# EAGLE schematic main_schematic (EAGLE 8.7.0)
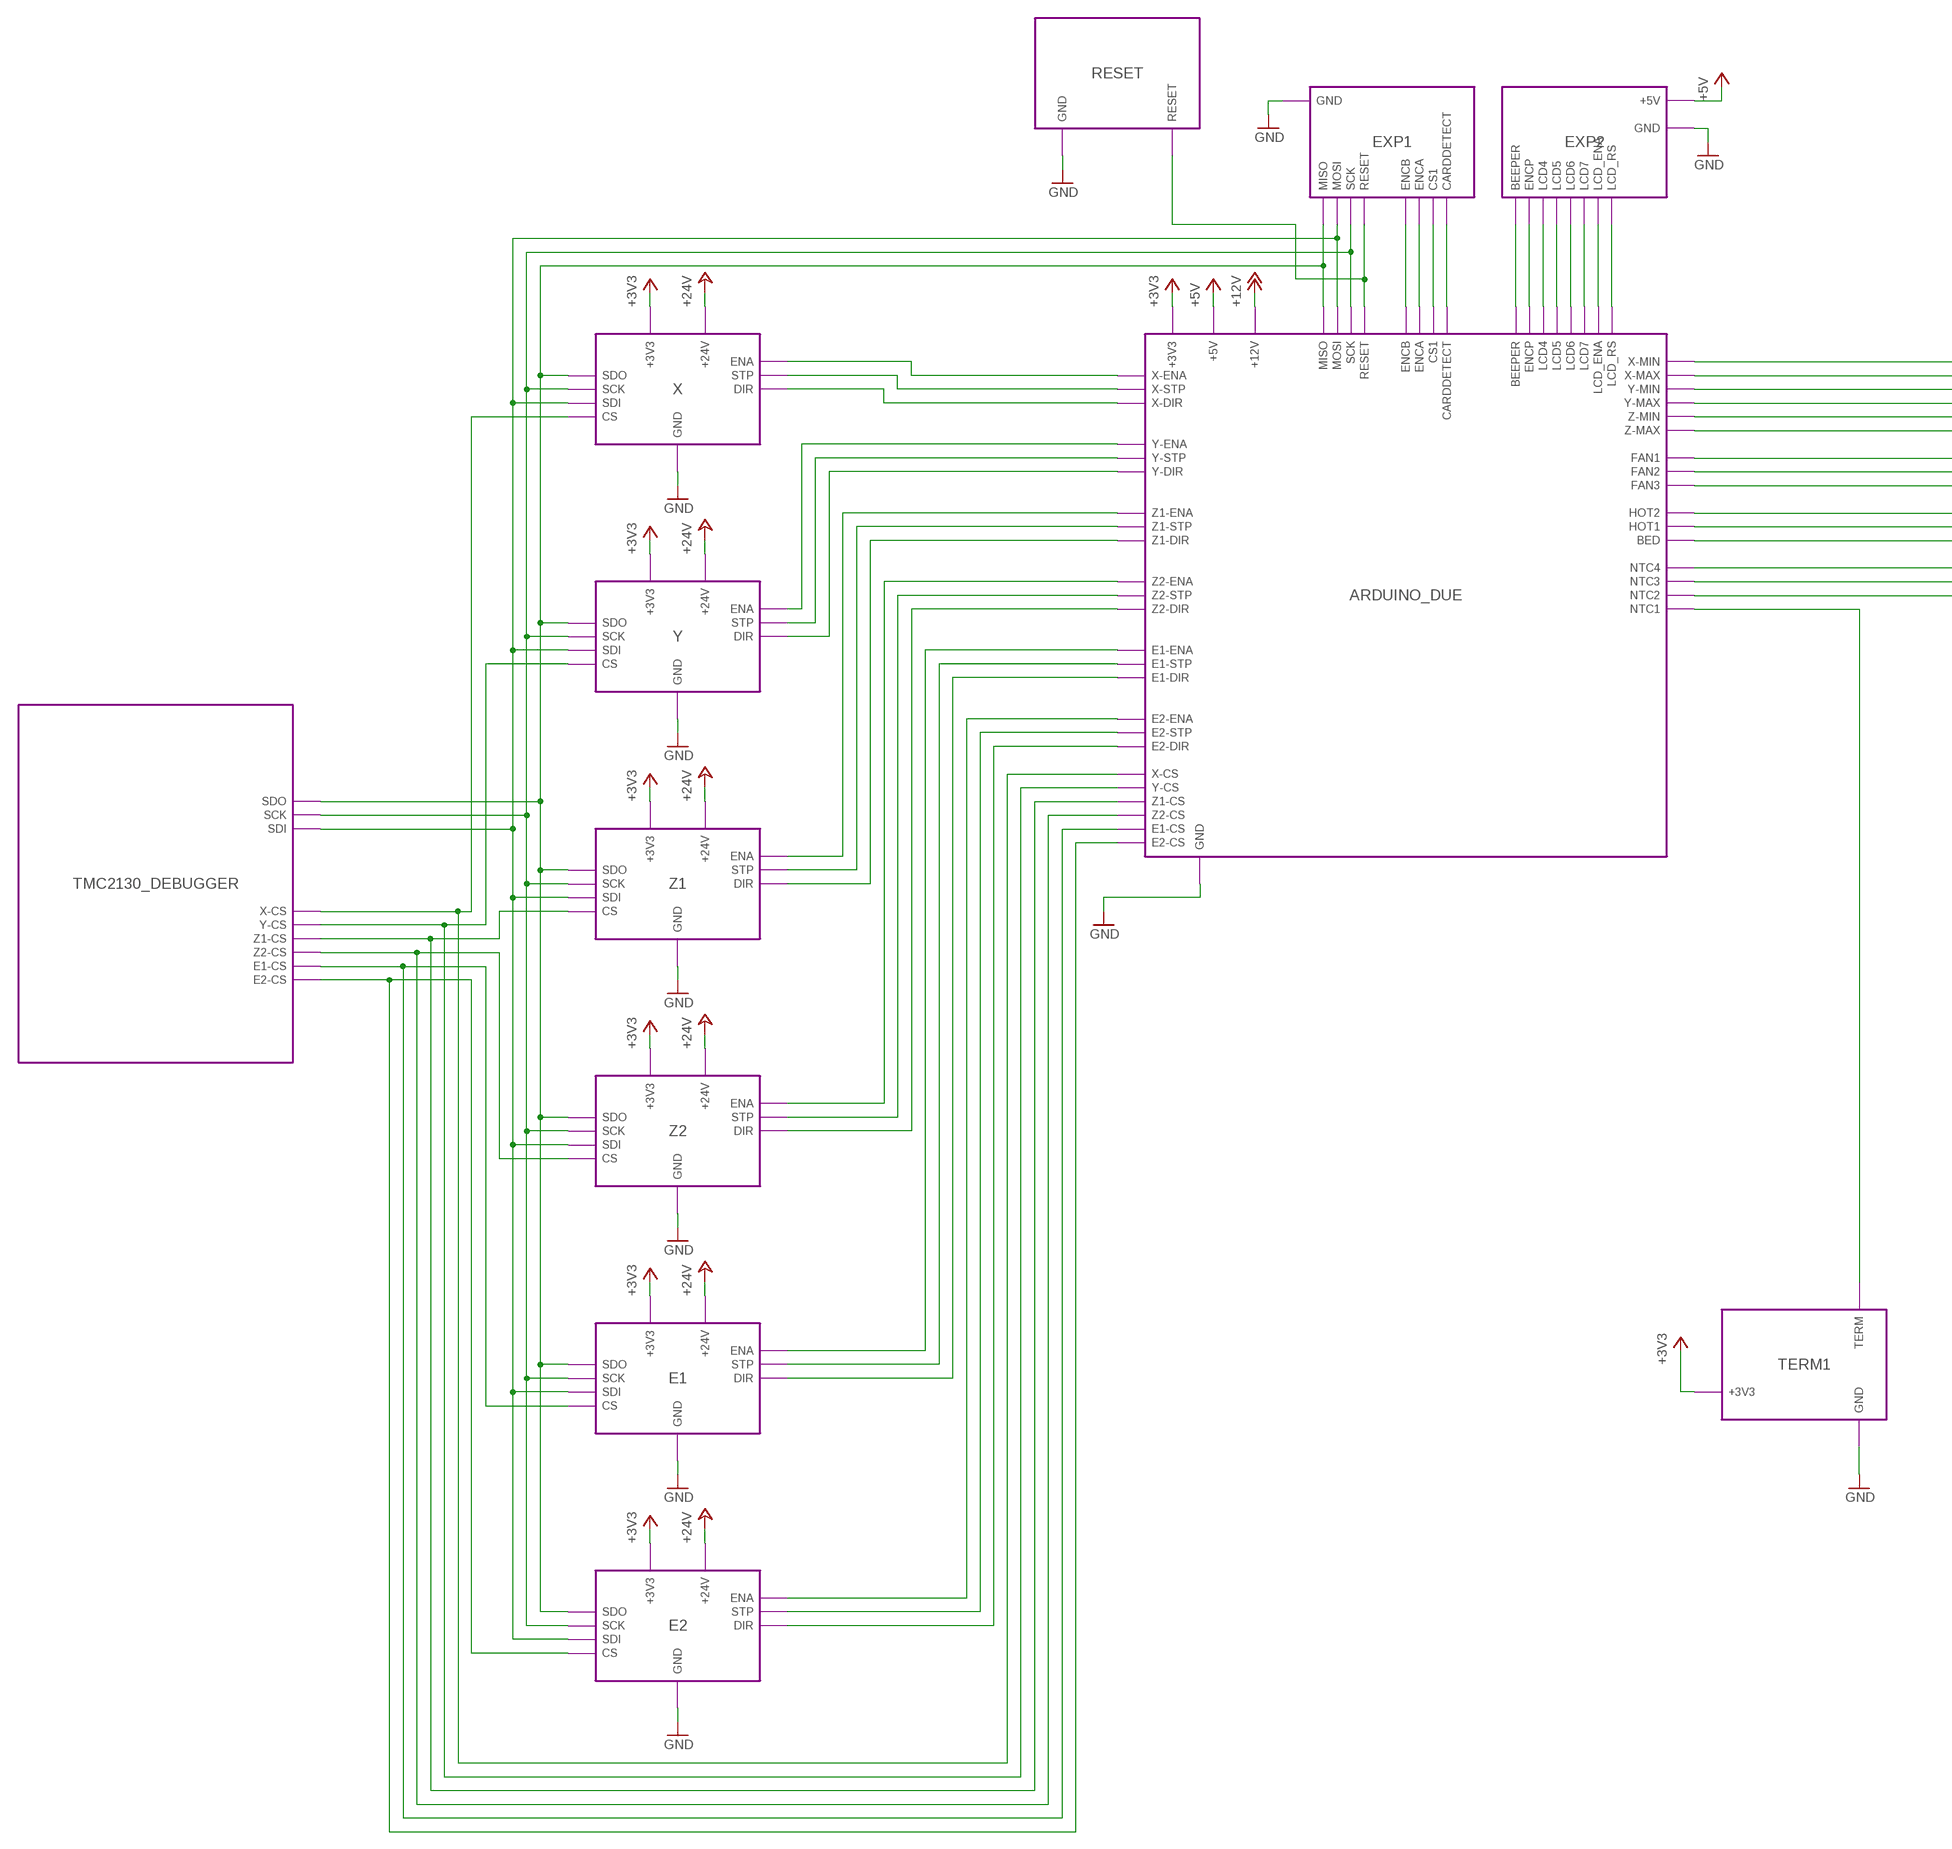
[diagram p0: schematic, sheet 1, part 1 of 2]
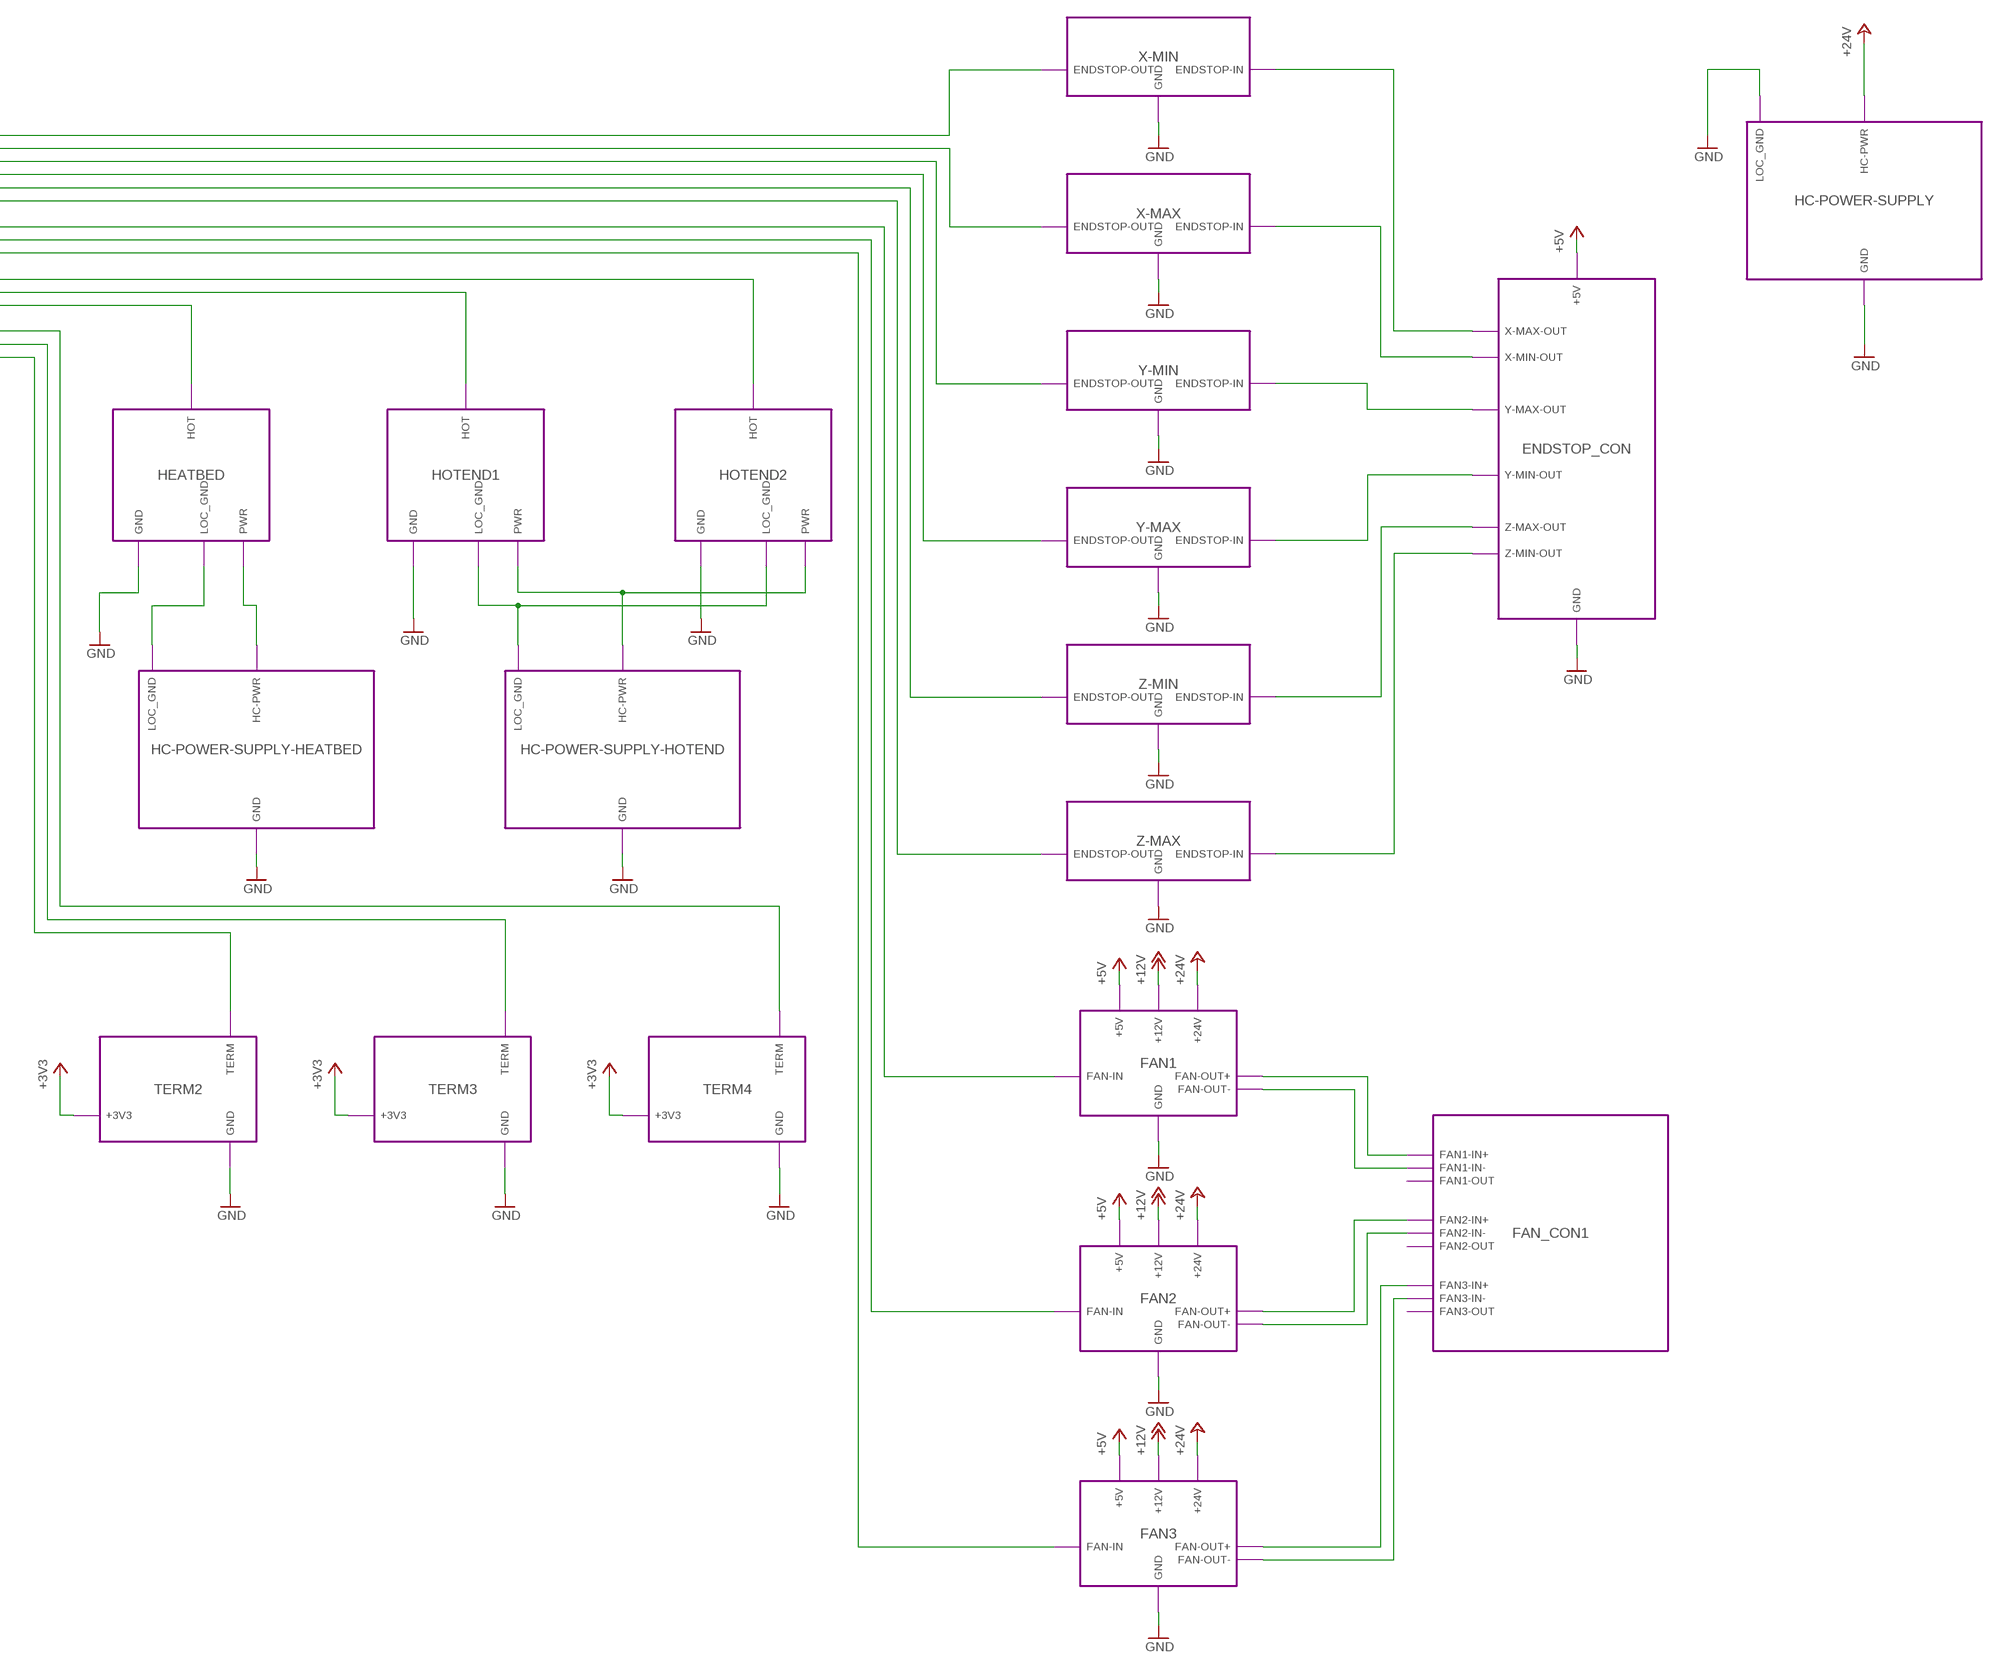
[diagram p1: schematic, sheet 1, part 2 of 2]

## Module instances
X-MIN = ENDSTOP
X-MAX = ENDSTOP
Y-MIN = ENDSTOP
Y-MAX = ENDSTOP
Z-MIN = ENDSTOP
Z-MAX = ENDSTOP
ARDUINO_DUE = CPU
ENDSTOP_CON = ENDSTOP_CON
FAN1 = FAN
FAN2 = FAN
FAN3 = FAN
FAN_CON1 = FAN_CON
EXP1 = EXP1
EXP2 = EXP2
X = MOTOR
Y = MOTOR
Z1 = MOTOR
Z2 = MOTOR
E1 = MOTOR
E2 = MOTOR
TMC2130_DEBUGGER = TMC2130_DEBUGGER
RESET = RESET
HOTEND1 = MOSFET-OUTPUT
HOTEND2 = MOSFET-OUTPUT
HC-POWER-SUPPLY-HOTEND = HC-POWER-SUPPLY
HC-POWER-SUPPLY-HEATBED = HC-POWER-SUPPLY
HC-POWER-SUPPLY = HC-POWER-SUPPLY
TERM1 = TERM
TERM2 = TERM
TERM3 = TERM
TERM4 = TERM
HEATBED = MOSFET-OUTPUT

## Nets
+3V3: port ARDUINO_DUE.+3V3 X.+3V3 Y.+3V3 Z1.+3V3 Z2.+3V3 E1.+3V3 E2.+3V3 TERM4.+3V3 TERM3.+3V3 TERM2.+3V3 TERM1.+3V3
+5V: port ENDSTOP_CON.+5V FAN1.+5V FAN2.+5V FAN3.+5V ARDUINO_DUE.+5V EXP2.+5V
+12V: port FAN3.+12V FAN2.+12V FAN1.+12V ARDUINO_DUE.+12V
+24V: port FAN3.+24V FAN2.+24V FAN1.+24V X.+24V Y.+24V Z1.+24V Z2.+24V E1.+24V E2.+24V HC-POWER-SUPPLY.HC-PWR
GND: port Y-MAX.GND Z-MIN.GND Z-MAX.GND Y-MIN.GND X-MAX.GND X-MIN.GND ENDSTOP_CON.GND FAN1.GND FAN2.GND FAN3.GND ARDUINO_DUE.GND EXP1.GND EXP2.GND X.GND Y.GND Z1.GND Z2.GND E1.GND E2.GND RESET.GND HC-POWER-SUPPLY-HEATBED.GND HC-POWER-SUPPLY-HOTEND.GND HOTEND1.GND HOTEND2.GND HEATBED.GND TERM4.GND TERM3.GND TERM2.GND TERM1.GND HC-POWER-SUPPLY.LOC_GND HC-POWER-SUPPLY.GND
N$1: port ARDUINO_DUE.MISO EXP1.MISO X.SDO Y.SDO Z1.SDO Z2.SDO E1.SDO E2.SDO TMC2130_DEBUGGER.SDO
N$2: port ARDUINO_DUE.MOSI EXP1.MOSI X.SDI E2.SDI Y.SDI E1.SDI Z2.SDI Z1.SDI TMC2130_DEBUGGER.SDI
N$3: port ARDUINO_DUE.SCK EXP1.SCK X.SCK Y.SCK Z1.SCK Z2.SCK E1.SCK E2.SCK TMC2130_DEBUGGER.SCK
N$4: port ARDUINO_DUE.RESET EXP1.RESET RESET.RESET
N$5: port ARDUINO_DUE.ENCB EXP1.ENCB
N$6: port ARDUINO_DUE.ENCA EXP1.ENCA
N$7: port ARDUINO_DUE.CS1 EXP1.CS1
N$8: port ARDUINO_DUE.CARDDETECT EXP1.CARDDETECT
N$9: port ARDUINO_DUE.BEEPER EXP2.BEEPER
N$10: port ARDUINO_DUE.ENCP EXP2.ENCP
N$11: port ARDUINO_DUE.X-MIN X-MIN.ENDSTOP-OUT
N$12: port ARDUINO_DUE.LCD4 EXP2.LCD4
N$13: port ARDUINO_DUE.LCD5 EXP2.LCD5
N$14: port ARDUINO_DUE.LCD6 EXP2.LCD6
N$15: port ARDUINO_DUE.LCD7 EXP2.LCD7
N$16: port ARDUINO_DUE.LCD_ENA EXP2.LCD_ENA
N$17: port ARDUINO_DUE.LCD_RS EXP2.LCD_RS
N$18: port ARDUINO_DUE.X-ENA X.ENA
N$19: port ARDUINO_DUE.X-STP X.STP
N$20: port ARDUINO_DUE.X-DIR X.DIR
N$21: port ARDUINO_DUE.Y-ENA Y.ENA
N$22: port ARDUINO_DUE.Y-STP Y.STP
N$23: port ARDUINO_DUE.Y-DIR Y.DIR
N$24: port ARDUINO_DUE.X-MAX X-MAX.ENDSTOP-OUT
N$25: port ARDUINO_DUE.Z1-ENA Z1.ENA
N$26: port ARDUINO_DUE.Y-MIN Y-MIN.ENDSTOP-OUT
N$27: port ARDUINO_DUE.Y-MAX Y-MAX.ENDSTOP-OUT
N$28: port ARDUINO_DUE.Z-MIN Z-MIN.ENDSTOP-OUT
N$29: port ARDUINO_DUE.Z-MAX Z-MAX.ENDSTOP-OUT
N$30: port ENDSTOP_CON.X-MAX-OUT X-MIN.ENDSTOP-IN
N$31: port ENDSTOP_CON.X-MIN-OUT X-MAX.ENDSTOP-IN
N$32: port ENDSTOP_CON.Y-MAX-OUT Y-MIN.ENDSTOP-IN
N$33: port ENDSTOP_CON.Y-MIN-OUT Y-MAX.ENDSTOP-IN
N$34: port ENDSTOP_CON.Z-MAX-OUT Z-MIN.ENDSTOP-IN
N$35: port ENDSTOP_CON.Z-MIN-OUT Z-MAX.ENDSTOP-IN
N$36: port FAN1.FAN-OUT+ FAN_CON1.FAN1-IN+
N$37: port FAN1.FAN-OUT- FAN_CON1.FAN1-IN-
N$38: port FAN2.FAN-OUT+ FAN_CON1.FAN2-IN+
N$39: port FAN2.FAN-OUT- FAN_CON1.FAN2-IN-
N$40: port FAN3.FAN-OUT+ FAN_CON1.FAN3-IN+
N$41: port FAN3.FAN-OUT- FAN_CON1.FAN3-IN-
N$42: port ARDUINO_DUE.Z1-STP Z1.STP
N$43: port ARDUINO_DUE.Z1-DIR Z1.DIR
N$44: port ARDUINO_DUE.Z2-ENA Z2.ENA
N$45: port ARDUINO_DUE.Z2-STP Z2.STP
N$46: port ARDUINO_DUE.Z2-DIR Z2.DIR
N$47: port ARDUINO_DUE.E1-ENA E1.ENA
N$48: port ARDUINO_DUE.FAN1 FAN1.FAN-IN
N$49: port ARDUINO_DUE.FAN2 FAN2.FAN-IN
N$50: port ARDUINO_DUE.FAN3 FAN3.FAN-IN
N$51: port ARDUINO_DUE.E1-STP E1.STP
N$52: port ARDUINO_DUE.E1-DIR E1.DIR
N$53: port ARDUINO_DUE.E2-ENA E2.ENA
N$54: port ARDUINO_DUE.E2-STP E2.STP
N$55: port ARDUINO_DUE.E2-DIR E2.DIR
N$56: port TMC2130_DEBUGGER.X-CS X.CS ARDUINO_DUE.X-CS
N$57: port Y.CS TMC2130_DEBUGGER.Y-CS ARDUINO_DUE.Y-CS
N$58: port Z1.CS TMC2130_DEBUGGER.Z1-CS ARDUINO_DUE.Z1-CS
N$59: port TMC2130_DEBUGGER.Z2-CS Z2.CS ARDUINO_DUE.Z2-CS
N$60: port TMC2130_DEBUGGER.E1-CS E1.CS ARDUINO_DUE.E1-CS
N$61: port E2.CS TMC2130_DEBUGGER.E2-CS ARDUINO_DUE.E2-CS
N$62: port HC-POWER-SUPPLY-HOTEND.LOC_GND HOTEND1.LOC_GND HOTEND2.LOC_GND
N$63: port HC-POWER-SUPPLY-HOTEND.HC-PWR HOTEND1.PWR HOTEND2.PWR
N$64: port ARDUINO_DUE.HOT2 HOTEND2.HOT
N$65: port ARDUINO_DUE.HOT1 HOTEND1.HOT
N$66: port HC-POWER-SUPPLY-HEATBED.LOC_GND HEATBED.LOC_GND
N$67: port HC-POWER-SUPPLY-HEATBED.HC-PWR HEATBED.PWR
N$68: port ARDUINO_DUE.BED HEATBED.HOT
N$69: port TERM4.TERM ARDUINO_DUE.NTC4
N$70: port ARDUINO_DUE.NTC3 TERM3.TERM
N$71: port ARDUINO_DUE.NTC2 TERM2.TERM
N$72: port ARDUINO_DUE.NTC1 TERM1.TERM

## Library data of the parts

## Module ENDSTOP
Ports: ENDSTOP-IN(in) ENDSTOP-OUT(out) GND(pwr)
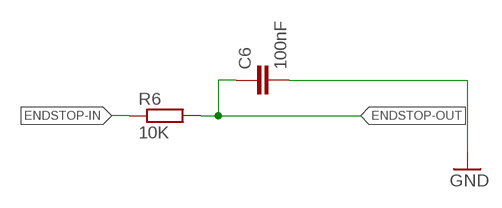
[diagram p2: schematic, module ENDSTOP, sheet 1]

### Parts
C6  100nF  C-EUC0805  [C0805]
R6  10K  R-EU_R0805  [R0805]

### Nets
ENDSTOP-IN: R6.1
ENDSTOP-OUT: C6.1 R6.2
GND: C6.2

### Library data of the parts
C6 = resistor:C-EU: CAPACITOR, European symbol
R6 = resistor:R-EU_: RESISTOR, European symbol

## Module CPU
Ports: X-MIN(in) X-MAX(in) Y-MIN(in) Y-MAX(in) Z-MIN(in) Z-MAX(in) +3V3(pwr) +5V(pwr) +12V(pwr) GND(pwr) FAN1(out) FAN2(out) FAN3(out) MISO(in) MOSI(out) SCK(out) RESET(in) ENCB(in) ENCA(in) CS1(out) CARDDETECT(in) BEEPER(out) ENCP(in) LCD4(out) LCD5(out) LCD6(out) LCD7(out) LCD_ENA(out) LCD_RS(out) Y-ENA(out) X-ENA(out) X-STP(out) X-DIR(out) Z1-STP(out) Y-STP(out) Y-DIR(out) Z1-ENA(out) Z1-DIR(out) Z2-ENA(out) Z2-STP(out) Z2-DIR(out) E1-ENA(out) E1-STP(out) E1-DIR(out) E2-ENA(out) E2-STP(out) E2-DIR(out) X-CS(out) Y-CS(out) Z1-CS(out) Z2-CS(out) E1-CS(out) E2-CS(out) HOT1(out) HOT2(out) BED(out) NTC4(in) NTC3(in) NTC2(in) NTC1(in)
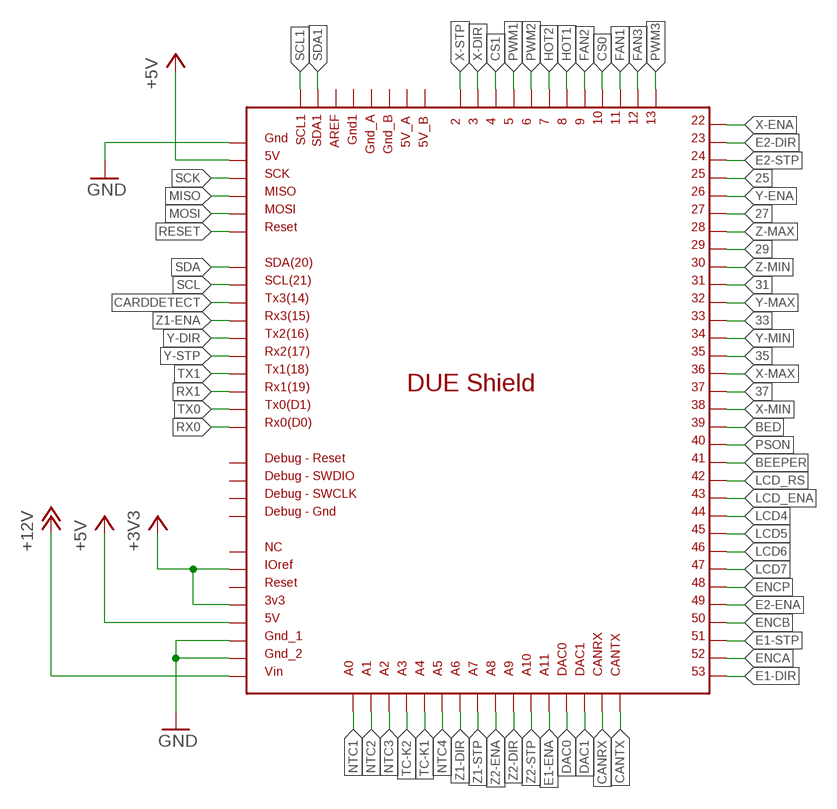
[diagram p3: schematic, module CPU, sheet 1]

### Parts
U$1  DUE(NORMAL)  [DUE(NORMAL)]

### Nets
25: U$1.25
27: U$1.27
29: U$1.29
31: U$1.31
33: U$1.33
35: U$1.35
37: U$1.37
+3V3: U$1.3V3 U$1.IOREF
+5V: U$1.5V U$1.GND_ICSP
+12V: U$1.VIN
BED: U$1.39
BEEPER: U$1.41
CANRX: U$1.CANRX
CANTX: U$1.CANTX
CARDDETECT: U$1.TX3
CS0: U$1.10
CS1: U$1.4
DAC0: U$1.DAC0
DAC1: U$1.DAC1
E1-DIR: U$1.53
E1-ENA: U$1.A11
E1-STP: U$1.51
E2-DIR: U$1.23
E2-ENA: U$1.49
E2-STP: U$1.24
ENCA: U$1.52
ENCB: U$1.50
ENCP: U$1.48
FAN1: U$1.11
FAN2: U$1.9
FAN3: U$1.12
GND: U$1.5V_ICSP U$1.GND_1 U$1.GND_2
HOT1: U$1.8
HOT2: U$1.7
LCD4: U$1.44
LCD5: U$1.45
LCD6: U$1.46
LCD7: U$1.47
LCD_ENA: U$1.43
LCD_RS: U$1.42
MISO: U$1.MISO_ICSP
MOSI: U$1.MOSI_ICSP
NTC1: U$1.A0
NTC2: U$1.A1
NTC3: U$1.A2
NTC4: U$1.A5
PSON: U$1.40
PWM1: U$1.5
PWM2: U$1.6
PWM3: U$1.13
RESET: U$1.RESET_ICSP
RX0: U$1.RX0
RX1: U$1.RX1
SCK: U$1.SCK_ICSP
SCL: U$1.SCL
SCL1: U$1.SCL1
SDA: U$1.SDA
SDA1: U$1.SDA1
TC-K1: U$1.A4
TC-K2: U$1.A3
TX0: U$1.TX0
TX1: U$1.TX1
X-DIR: U$1.3
X-ENA: U$1.22
X-MAX: U$1.36
X-MIN: U$1.38
X-STP: U$1.2
Y-DIR: U$1.TX2
Y-ENA: U$1.26
Y-MAX: U$1.32
Y-MIN: U$1.34
Y-STP: U$1.RX2
Z1-DIR: U$1.A6
Z1-ENA: U$1.RX3
Z1-STP: U$1.A7
Z2-DIR: U$1.A9
Z2-ENA: U$1.A8
Z2-STP: U$1.A10
Z-MAX: U$1.28
Z-MIN: U$1.30
Unconnected: U$1.5V_A U$1.5V_B U$1.AREF U$1.GND1 U$1.GND_A U$1.GND_B U$1.GND_DEBUG U$1.NC U$1.RESET U$1.RESET_DEBUG U$1.SWCLK_DEBUG U$1.SWDIO_DEBUG

### Library data of the parts
U$1 = DUElib130425:DUE(NORMAL)

## Module ENDSTOP_CON
Ports: X-MAX-OUT(out) X-MIN-OUT(out) Y-MAX-OUT(out) Y-MIN-OUT(out) Z-MAX-OUT(out) Z-MIN-OUT(out) +5V(pwr) GND(pwr)
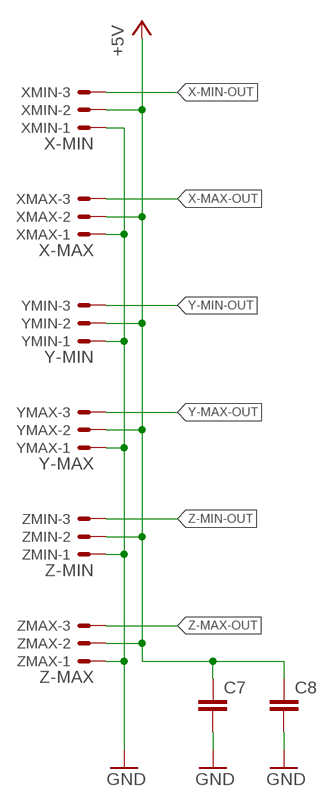
[diagram p4: schematic, module ENDSTOP_CON, sheet 1]

### Parts
C7  C-EUC0805  [C0805]
C8  C-EUC0805  [C0805]
XMAX  X-MAX  JST-XH-03-PIN-LONG-PAD  [JST-XH-03-PACKAGE-LONG-PAD]
XMIN  X-MIN  JST-XH-03-PIN-LONG-PAD  [JST-XH-03-PACKAGE-LONG-PAD]
YMAX  Y-MAX  JST-XH-03-PIN-LONG-PAD  [JST-XH-03-PACKAGE-LONG-PAD]
YMIN  Y-MIN  JST-XH-03-PIN-LONG-PAD  [JST-XH-03-PACKAGE-LONG-PAD]
ZMAX  Z-MAX  JST-XH-03-PIN-LONG-PAD  [JST-XH-03-PACKAGE-LONG-PAD]
ZMIN  Z-MIN  JST-XH-03-PIN-LONG-PAD  [JST-XH-03-PACKAGE-LONG-PAD]

### Nets
+5V: C7.1 C8.1 XMAX.2 XMIN.2 YMAX.2 YMIN.2 ZMAX.2 ZMIN.2
GND: C7.2 C8.2 XMAX.1 XMIN.1 YMAX.1 YMIN.1 ZMAX.1 ZMIN.1
X-MAX-OUT: XMAX.3
X-MIN-OUT: XMIN.3
Y-MAX-OUT: YMAX.3
Y-MIN-OUT: YMIN.3
Z-MAX-OUT: ZMAX.3
Z-MIN-OUT: ZMIN.3

### Library data of the parts
C7 C8 = resistor:C-EU: CAPACITOR, European symbol
XMAX XMIN YMAX YMIN ZMAX ZMIN = Rembrandt Electronics - JST XH Connectors v1-0:JST-XH-03-PIN: JST XH Connector 2 Pin Wire to board connector. Pitch: 2,54 mm, (0.100") Number of pins: 3 Created by Rembrandt Electronics www.rembrandtelectronics.com

## Module FAN
Ports: FAN-IN(in) FAN-OUT+(out) FAN-OUT-(out) GND(pwr) +5V(pwr) +12V(pwr) +24V(pwr)
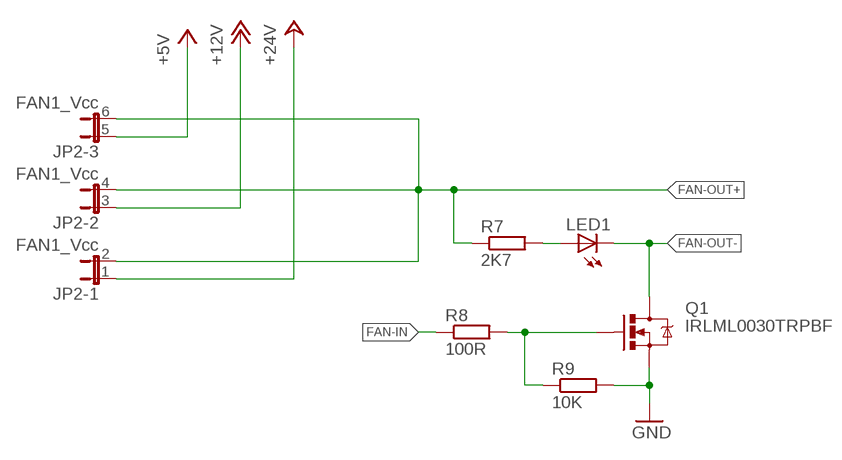
[diagram p5: schematic, module FAN, sheet 1]

### Parts
JP2  FAN1_Vcc  JP3QE  [JP3Q]
LED1  LEDSMT1206  [1206]
Q1  IRLML0030TRPBF  MOSFET-NCHANNELSMD  [SOT23-3]
R7  2K7  R-EU_R0805  [R0805]
R8  100R  R-EU_R0805  [R0805]
R9  10K  R-EU_R0805  [R0805]

### Nets
+5V: JP2.5
+12V: JP2.3
+24V: JP2.1
FAN-IN: R8.1
FAN-OUT+: JP2.2 JP2.4 JP2.6 R7.1
FAN-OUT-: LED1.C Q1.3(D)
GND: Q1.2(S) R9.2
N$2: LED1.A R7.2
N$5: Q1.1(G) R8.2 R9.1

### Library data of the parts
JP2 = jumper:JP3QE: JUMPER
LED1 = led:LED: LED OSRAM: - CHIPLED LG R971, LG N971, LY N971, LG Q971, LY Q971, LO R971, LY R971 LH N974, LH R974 LS Q976, LO Q976, LY Q976 LO Q996 - Hyper CHIPLED LW Q18S LB Q993, LB Q99A, LB R99A - SideLED LS A670, LO A670, LY A670, LG A670, LP A670 LB A673, LV A673, LT A673, LW A673 LH A674 LY A675 LS A676, LA A676, LO A676, LY A676, LW A676 LS A679, LY A679, LG A679 - Hyper Micro SIDELED® LS Y876, LA Y876, LO Y876, LY Y876 LT Y87S - SmartLED LW L88C, LW L88S LB L89C, LB L89S, LG L890 LS L89K, LO L89K, LY L89K LS L896, LA L896, LO L896, LY L896 - TOPLED LS T670, LO T670, LY T670, LG T670, LP T670 LSG T670, LSP T670, LSY T670, LOP T670, LYG T670 LG T671, LOG T671, LSG T671 LB T673, LV T673, LT T673, LW T673 LH T674 LS T676, LA T676, LO T676, LY T676, LB T676, LH T676, LSB T676, LW T676 LB T67C, LV T67C, LT T67C, LS T67K, LO T67K, LY T67K, LW E67C LS E67B, LA E67B, LO E67B, LY E67B, LB E67C, LV E67C, LT E67C LW T67C LS T679, LY T679, LG T679 LS T770, LO T770, LY T770, LG T770, LP T770 LB T773, LV T773, LT T773, LW T773 LH T774 LS E675, LA E675, LY E675, LS T675 LS T776, LA T776, LO T776, LY T776, LB T776 LHGB T686 LT T68C, LB T68C - Hyper Mini TOPLED® LB M676 - Mini TOPLED Santana® LG M470 LS M47K, LO M47K, LY M47K Source: http://www.osram.convergy.de LUXEON: - LUMILED® LXK2-PW12-R00, LXK2-PW12-S00, LXK2-PW14-U00, LXK2-PW14-V00 LXK2-PM12-R00, LXK2-PM12-S00, LXK2-PM14-U00 LXK2-PE12-Q00, LXK2-PE12-R00, LXK2-PE12-S00, LXK2-PE14-T00, LXK2-PE14-U00 LXK2-PB12-K00, LXK2-PB12-L00, LXK2-PB12-M00, LXK2-PB14-N00, LXK2-PB14-P00, LXK2-PB14-Q00 LXK2-PR12-L00, LXK2-PR12-M00, LXK2-PR14-Q00, LXK2-PR14-R00 LXK2-PD12-Q00, LXK2-PD12-R00, LXK2-PD12-S00 LXK2-PH12-R00, LXK2-PH12-S00 LXK2-PL12-P00, LXK2-PL12-Q00, LXK2-PL12-R00 Source: www.luxeon.com KINGBRIGHT: KA-3528ASYC Source: www.kingbright.com
Q1 = fets:MOSFET-NCHANNEL: Generic NMOS footprint
R7-R9 = resistor:R-EU_: RESISTOR, European symbol

## Module FAN_CON
Ports: FAN1-IN+(in) FAN1-IN-(in) FAN1-OUT(out) FAN2-IN+(in) FAN2-IN-(in) FAN2-OUT(out) FAN3-IN+(in) FAN3-IN-(in) FAN3-OUT(out)
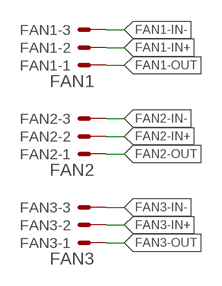
[diagram p6: schematic, module FAN_CON, sheet 1]

### Parts
FAN1  FAN1  JST-XH-03-PIN-LONG-PAD  [JST-XH-03-PACKAGE-LONG-PAD]
FAN2  FAN2  JST-XH-03-PIN-LONG-PAD  [JST-XH-03-PACKAGE-LONG-PAD]
FAN3  FAN3  JST-XH-03-PIN-LONG-PAD  [JST-XH-03-PACKAGE-LONG-PAD]

### Nets
FAN1-IN+: FAN1.2
FAN1-IN-: FAN1.3
FAN1-OUT: FAN1.1
FAN2-IN+: FAN2.2
FAN2-IN-: FAN2.3
FAN2-OUT: FAN2.1
FAN3-IN+: FAN3.2
FAN3-IN-: FAN3.3
FAN3-OUT: FAN3.1

### Library data of the parts
FAN1-FAN3 = Rembrandt Electronics - JST XH Connectors v1-0:JST-XH-03-PIN: JST XH Connector 2 Pin Wire to board connector. Pitch: 2,54 mm, (0.100") Number of pins: 3 Created by Rembrandt Electronics www.rembrandtelectronics.com

## Module EXP2
Ports: BEEPER(in) ENCP(out) LCD4(in) LCD5(in) LCD6(in) LCD7(in) LCD_ENA(in) LCD_RS(in) +5V(pwr) GND(pwr)
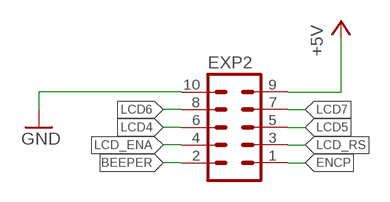
[diagram p7: schematic, module EXP2, sheet 1]

### Parts
EXP2  MA05-2  [MA05-2]

### Nets
+5V: EXP2.9
BEEPER: EXP2.2
ENCP: EXP2.1
GND: EXP2.10
LCD4: EXP2.6
LCD5: EXP2.5
LCD6: EXP2.8
LCD7: EXP2.7
LCD_ENA: EXP2.4
LCD_RS: EXP2.3

### Library data of the parts
EXP2 = con-lstb:MA05-2: PIN HEADER; OC_FARNELL: unknown; OC_NEWARK: unknown

## Module EXP1
Ports: CARDDETECT(out) CS1(in) ENCA(out) ENCB(out) GND(pwr) MISO(out) MOSI(in) RESET(out) SCK(in)
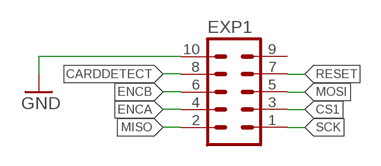
[diagram p8: schematic, module EXP1, sheet 1]

### Parts
EXP1  MA05-2  [MA05-2]

### Nets
CARDDETECT: EXP1.8
CS1: EXP1.3
ENCA: EXP1.4
ENCB: EXP1.6
GND: EXP1.10
MISO: EXP1.2
MOSI: EXP1.5
RESET: EXP1.7
SCK: EXP1.1
Unconnected: EXP1.9

### Library data of the parts
EXP1 = con-lstb:MA05-2: PIN HEADER; OC_FARNELL: unknown; OC_NEWARK: unknown

## Module MOTOR
Ports: ENA(in) STP(in) DIR(in) +3V3(pwr) +24V(pwr) SDO(out) SCK(in) SDI(in) CS(in) GND(pwr)
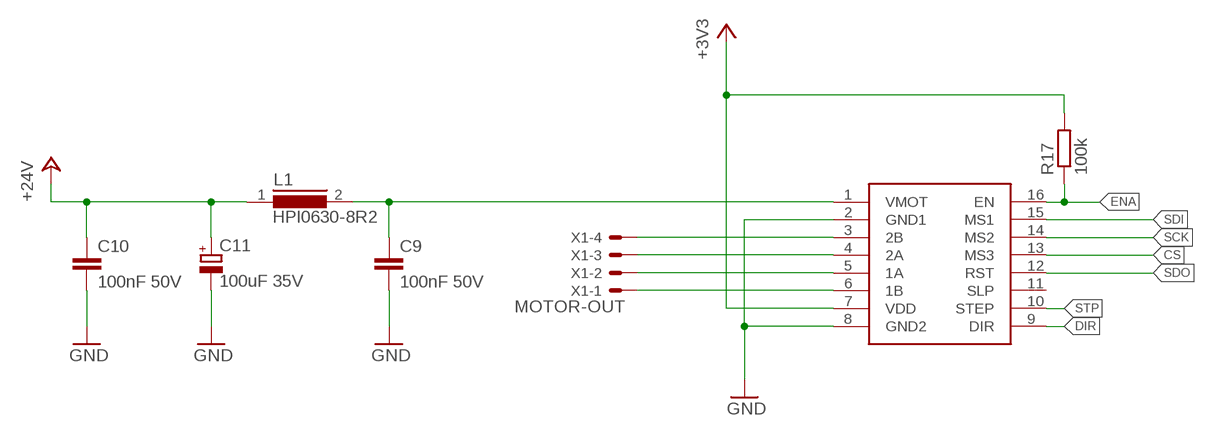
[diagram p9: schematic, module MOTOR, sheet 1]

### Parts
C9  100nF 50V  C-EUC0805  [C0805]
C10  100nF 50V  C-EUC0805  [C0805]
C11  100uF 35V  CPOL-EUB  [PANASONIC_B]
L1  HPI0630-8R2  DLG-0504  [DLG-0504]
R17  100k  R-EU_R0805  [R0805]
U$2  POLOLUESTEPPERDRIVER  [DIL16]
X1  MOTOR-OUT  JST-XH-04-PIN-LONG-PAD  [JST-XH-04-PACKAGE-LONG-PAD]

### Nets
+3V3: R17.2 U$2.7(VDD)
+24V: C10.1 C11.+ L1.1
CS: U$2.13(MS3)
DIR: U$2.9(DIR)
ENA: R17.1 U$2.16(EN)
GND: C9.2 C10.2 C11.- U$2.2(GND1) U$2.8(GND2)
N$7: U$2.3(2B) X1.4
N$8: U$2.4(2A) X1.3
N$9: U$2.5(1A) X1.2
N$10: U$2.6(1B) X1.1
N$25: C9.1 L1.2 U$2.1(VMOT)
SCK: U$2.14(MS2)
SDI: U$2.15(MS1)
SDO: U$2.12(RST)
STP: U$2.10(STEP)
Unconnected: U$2.11(SLP)

### Library data of the parts
C9 C10 = resistor:C-EU: CAPACITOR, European symbol
C11 = resistor:CPOL-EU: POLARIZED CAPACITOR, European symbol
L1 = DLG-0504:DLG-0504
R17 = resistor:R-EU_: RESISTOR, European symbol
U$2 = reprap:POLOLUESTEPPERDRIVER: Pololu stepper driver based on the A4983.
X1 = Rembrandt Electronics - JST XH Connectors v1-0:JST-XH-04-PIN: JST XH Connector 2 Pin Wire to board connector. Pitch: 2,54 mm, (0.100") Number of pins: 4 Created by Rembrandt Electronics www.rembrandtelectronics.com

## Module TMC2130_DEBUGGER
Ports: SDO(in) SCK(out) SDI(out) X-CS(out) Y-CS(out) Z1-CS(out) Z2-CS(out) E1-CS(out) E2-CS(out)

### Library data of the parts

## Module RESET
Ports: RESET(out) GND(pwr)
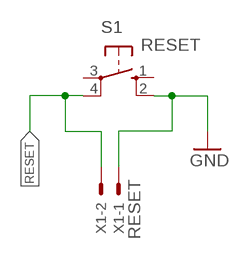
[diagram p10: schematic, module RESET, sheet 1]

### Parts
S1  RESET  10-XX  [B3F-10XX]
X1  RESET  JST-XH-02-PIN-LONG-PAD  [JST-XH-02-PACKAGE-LONG-PAD]

### Nets
GND: S1.2(S1) X1.1
RESET: S1.4(P1) X1.2
Unconnected: S1.1(S) S1.3(P)

### Library data of the parts
S1 = switch-omron:10-XX: OMRON SWITCH; MPN: B3F-1000; OC_FARNELL: 176432; OC_NEWARK: 36M3542
X1 = Rembrandt Electronics - JST XH Connectors v1-0:JST-XH-02-PIN: JST XH Connector 2 Pin Wire to board connector. Pitch: 2,54 mm, (0.100") Number of pins: 2 Created by Rembrandt Electronics www.rembrandtelectronics.com

## Module MOSFET-OUTPUT
Ports: LOC_GND(pwr) PWR(pwr) GND(pwr) HOT(in)
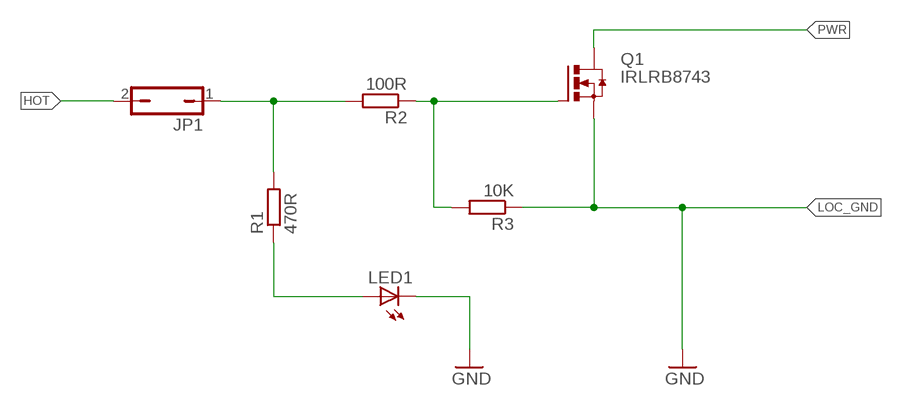
[diagram p11: schematic, module MOSFET-OUTPUT, sheet 1]

### Parts
JP1  JP1Q  [JP1]
LED1  LEDSML0805  [SML0805]
Q1  IRLRB8743  IRF3704  [TO220AH]
R1  470R  R-EU_R0805  [R0805]
R2  100R  R-EU_R0805  [R0805]
R3  10K  R-EU_R0805  [R0805]

### Nets
GND: LED1.C
HOT: JP1.2
LOC_GND: Q1.E(S) R3.1 ; supply symbol labelled GND
N$1: JP1.1 R1.2 R2.2
N$2: LED1.A R1.1
N$3: Q1.B(G) R2.1 R3.2
PWR: Q1.C(D)

### Library data of the parts
JP1 = jumper:JP1Q: JUMPER
LED1 = led:LED: LED OSRAM: - CHIPLED LG R971, LG N971, LY N971, LG Q971, LY Q971, LO R971, LY R971 LH N974, LH R974 LS Q976, LO Q976, LY Q976 LO Q996 - Hyper CHIPLED LW Q18S LB Q993, LB Q99A, LB R99A - SideLED LS A670, LO A670, LY A670, LG A670, LP A670 LB A673, LV A673, LT A673, LW A673 LH A674 LY A675 LS A676, LA A676, LO A676, LY A676, LW A676 LS A679, LY A679, LG A679 - Hyper Micro SIDELED® LS Y876, LA Y876, LO Y876, LY Y876 LT Y87S - SmartLED LW L88C, LW L88S LB L89C, LB L89S, LG L890 LS L89K, LO L89K, LY L89K LS L896, LA L896, LO L896, LY L896 - TOPLED LS T670, LO T670, LY T670, LG T670, LP T670 LSG T670, LSP T670, LSY T670, LOP T670, LYG T670 LG T671, LOG T671, LSG T671 LB T673, LV T673, LT T673, LW T673 LH T674 LS T676, LA T676, LO T676, LY T676, LB T676, LH T676, LSB T676, LW T676 LB T67C, LV T67C, LT T67C, LS T67K, LO T67K, LY T67K, LW E67C LS E67B, LA E67B, LO E67B, LY E67B, LB E67C, LV E67C, LT E67C LW T67C LS T679, LY T679, LG T679 LS T770, LO T770, LY T770, LG T770, LP T770 LB T773, LV T773, LT T773, LW T773 LH T774 LS E675, LA E675, LY E675, LS T675 LS T776, LA T776, LO T776, LY T776, LB T776 LHGB T686 LT T68C, LB T68C - Hyper Mini TOPLED® LB M676 - Mini TOPLED Santana® LG M470 LS M47K, LO M47K, LY M47K Source: http://www.osram.convergy.de LUXEON: - LUMILED® LXK2-PW12-R00, LXK2-PW12-S00, LXK2-PW14-U00, LXK2-PW14-V00 LXK2-PM12-R00, LXK2-PM12-S00, LXK2-PM14-U00 LXK2-PE12-Q00, LXK2-PE12-R00, LXK2-PE12-S00, LXK2-PE14-T00, LXK2-PE14-U00 LXK2-PB12-K00, LXK2-PB12-L00, LXK2-PB12-M00, LXK2-PB14-N00, LXK2-PB14-P00, LXK2-PB14-Q00 LXK2-PR12-L00, LXK2-PR12-M00, LXK2-PR14-Q00, LXK2-PR14-R00 LXK2-PD12-Q00, LXK2-PD12-R00, LXK2-PD12-S00 LXK2-PH12-R00, LXK2-PH12-S00 LXK2-PL12-P00, LXK2-PL12-Q00, LXK2-PL12-R00 Source: www.luxeon.com KINGBRIGHT: KA-3528ASYC Source: www.kingbright.com
Q1 = transistor-power:IRF3704: SMPS MOSFET HEXFET® Power MOSFET Source: http://www.irf.com/product-info/datasheets/data/irf3704.pdf
R1-R3 = resistor:R-EU_: RESISTOR, European symbol

## Module HC-POWER-SUPPLY
Ports: GND(pwr) HC-PWR(pwr) LOC_GND(pwr)
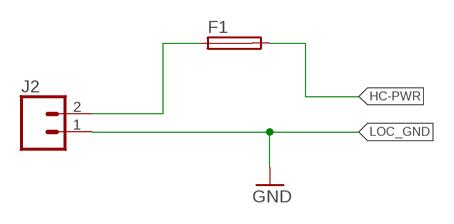
[diagram p12: schematic, module HC-POWER-SUPPLY, sheet 1]

### Parts
F1  SH22  [SH22]
J2  CONN_025MM  [SCREWTERMINAL-5MM-2]

### Nets
HC-PWR: F1.2
LOC_GND: J2.1 ; supply symbol labelled GND
N$1: F1.1 J2.2

### Library data of the parts
F1 = fuse:SH22: FUSE HOLDER CS PFP30, Schukat; OC_FARNELL: unknown; OC_NEWARK: unknown
J2 = SparkFun-Connectors:CONN_02: Multi connection point. Often used as Generic Header-pin footprint for 0.1 inch spaced/style header connections On any of the 0.1 inch spaced packages, you can populate with these: Break Away Headers - Straight <https://www.sparkfun.com/products/116> (PRT-00116) Break Away Male Headers - Right Angle <https://www.sparkfun.com/products/553> (PRT-00553) Female Headers <https://www.sparkfun.com/products/115> (PRT-00115) Break Away Headers - Machine Pin <https://www.sparkfun.com/products/117> (PRT-00117) Break Away Female Headers - Swiss Machine Pin <https://www.sparkfun.com/products/743> (PRT-00743) For SCREWTERMINALS and SPRING TERMINALS visit here: Screw Terimnals on SparkFun.com <https://www.sparkfun.com/search/results?term=Screw+Terminals> (5mm/3.5mm/2.54mm spacing) This device is also useful as a general connection point to wire up your design to another part of your project. Our various solder wires solder well into these plated through hole pads. Hook-Up Wire - Assortment (Stranded, 22 AWG) <https://www.sparkfun.com/products/11375> (PRT-11375) Hook-Up Wire - Assortment (Solid Core, 22 AWG) <https://www.sparkfun.com/products/11367> (PRT-11367) View the entire wire category on our website here <https://www.sparkfun.com/categories/141> Special notes: Molex polarized connector foot print use with: PRT-08233 with associated crimp pins and housings. 2.54_SCREWTERM for use with PRT-10571. 3.5mm Screw Terminal footprints for PRT-08084 5mm Screw Terminal footprints for use with PRT-08432; SF_SKU: PRT-08432

## Module TERM
Ports: TERM(out) +3V3(pwr) GND(pwr)
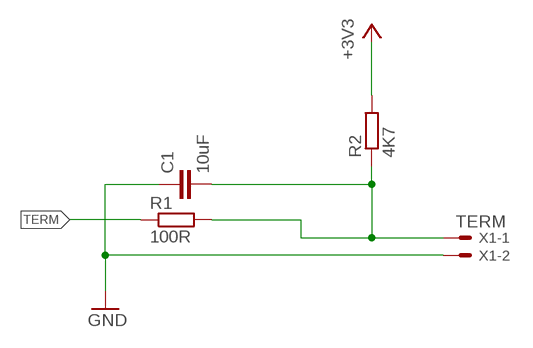
[diagram p13: schematic, module TERM, sheet 1]

### Parts
C1  10uF  C-EUC0805  [C0805]
R1  100R  R-EU_R0805  [R0805]
R2  4K7  R-EU_R0805  [R0805]
X1  TERM  JST-XH-02-PIN-LONG-PAD  [JST-XH-02-PACKAGE-LONG-PAD]

### Nets
+3V3: R2.2
GND: C1.1 X1.2
N$1: C1.2 R1.2 R2.1 X1.1
TERM: R1.1

### Library data of the parts
C1 = resistor:C-EU: CAPACITOR, European symbol
R1 R2 = resistor:R-EU_: RESISTOR, European symbol
X1 = Rembrandt Electronics - JST XH Connectors v1-0:JST-XH-02-PIN: JST XH Connector 2 Pin Wire to board connector. Pitch: 2,54 mm, (0.100") Number of pins: 2 Created by Rembrandt Electronics www.rembrandtelectronics.com